# EAGLE design Power Distribution Board Task 6 (EAGLE 8.3.2)
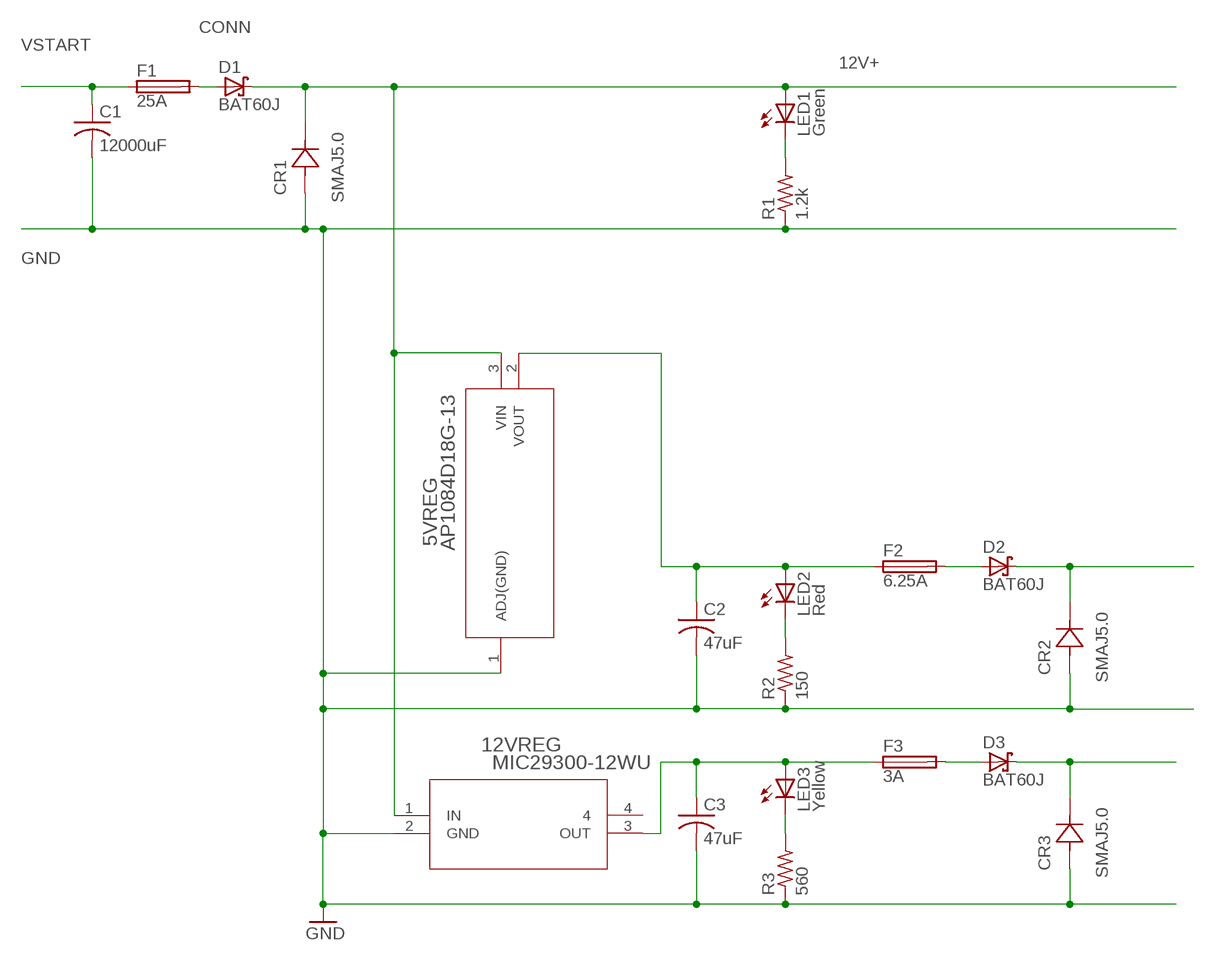
[diagram p0: schematic, sheet 1]

## Parts
5VREG  AP1084D18G-13  [TO252-3L]
12VREG  MIC29300-12WU  [TO-263-3]
C1  12000uF  C-USC1206K  [C1206K]
C2  47uF  C-USC1206K  [C1206K]
C3  47uF  C-USC1206K  [C1206K]
CR1  SMAJ5.0  [SMASERIES]
CR2  SMAJ5.0  [SMASERIES]
CR3  SMAJ5.0  [SMASERIES]
D1  BAT60J  [SOD323_ST]
D2  BAT60J  [SOD323_ST]
D3  BAT60J  [SOD323_ST]
F1  25A  TE5  [TE5]
F2  6.25A  TE5  [TE5]
F3  3A  TE5  [TE5]
LED1  Green  LEDCHIPLED_1206  [CHIPLED_1206]
LED2  Red  LEDCHIPLED_1206  [CHIPLED_1206]
LED3  Yellow  LEDCHIPLED_1206  [CHIPLED_1206]
R1  1.2k  R-US_R1206  [R1206]
R2  150  R-US_R1206  [R1206]
R3  560  R-US_R1206  [R1206]

## Nets
12V+: 5VREG.3(VIN) 12VREG.1(IN) CR1.1 D1.C LED1.A
CONN: D1.A F1.2
GND: 5VREG.1(ADJ(GND)) 12VREG.2(GND) C1.2 C2.2 C3.2 CR1.2 CR2.2 CR3.2 R1.1 R2.1 R3.1
N$6: LED1.C R1.2
N$12: D2.A F2.2
N$13: CR2.1 D2.C
N$15: LED2.C R2.2
N$17: D3.A F3.2
N$18: CR3.1 D3.C
N$20: LED3.C R3.2
VOUT2: 5VREG.2(VOUT) C2.1 F2.1 LED2.A
VOUT3: 12VREG.3(OUT) C3.1 F3.1 LED3.A
VSTART: C1.1 F1.1
Unconnected: 12VREG.4

## Library data of the parts
5VREG = AP108412v_5v:AP1084D18G-13; MANUFACTURER_PART_NUMBER: AP1084D18G13; VENDOR: Diodes Inc
12VREG = MIC29300_12v:MIC29300-12WU; MANUFACTURER_PART_NUMBER: MIC2930012WU; VENDOR: MICREL
C1-C3 = rcl:C-US: CAPACITOR, American symbol
CR1-CR3 = SMAJ5_diode:SMAJ5.0; MANUFACTURER_PART_NUMBER: SMAJ5.0; VENDOR: Littelfuse Inc
D1-D3 = diode:BAT60J: Schottky barrier diode Source: www.st.com, BAT60J.pdf
F1-F3 = fuse:TE5: FUSE Wickmann; OC_FARNELL: unknown; OC_NEWARK: unknown
LED1-LED3 = led:LED: LED OSRAM: - CHIPLED LG R971, LG N971, LY N971, LG Q971, LY Q971, LO R971, LY R971 LH N974, LH R974 LS Q976, LO Q976, LY Q976 LO Q996 - Hyper CHIPLED LW Q18S LB Q993, LB Q99A, LB R99A - SideLED LS A670, LO A670, LY A670, LG A670, LP A670 LB A673, LV A673, LT A673, LW A673 LH A674 LY A675 LS A676, LA A676, LO A676, LY A676, LW A676 LS A679, LY A679, LG A679 - Hyper Micro SIDELED® LS Y876, LA Y876, LO Y876, LY Y876 LT Y87S - SmartLED LW L88C, LW L88S LB L89C, LB L89S, LG L890 LS L89K, LO L89K, LY L89K LS L896, LA L896, LO L896, LY L896 - TOPLED LS T670, LO T670, LY T670, LG T670, LP T670 LSG T670, LSP T670, LSY T670, LOP T670, LYG T670 LG T671, LOG T671, LSG T671 LB T673, LV T673, LT T673, LW T673 LH T674 LS T676, LA T676, LO T676, LY T676, LB T676, LH T676, LSB T676, LW T676 LB T67C, LV T67C, LT T67C, LS T67K, LO T67K, LY T67K, LW E67C LS E67B, LA E67B, LO E67B, LY E67B, LB E67C, LV E67C, LT E67C LW T67C LS T679, LY T679, LG T679 LS T770, LO T770, LY T770, LG T770, LP T770 LB T773, LV T773, LT T773, LW T773 LH T774 LS E675, LA E675, LY E675, LS T675 LS T776, LA T776, LO T776, LY T776, LB T776 LHGB T686 LT T68C, LB T68C - Hyper Mini TOPLED® LB M676 - Mini TOPLED Santana® LG M470 LS M47K, LO M47K, LY M47K Source: http://www.osram.convergy.de LUXEON: - LUMILED® LXK2-PW12-R00, LXK2-PW12-S00, LXK2-PW14-U00, LXK2-PW14-V00 LXK2-PM12-R00, LXK2-PM12-S00, LXK2-PM14-U00 LXK2-PE12-Q00, LXK2-PE12-R00, LXK2-PE12-S00, LXK2-PE14-T00, LXK2-PE14-U00 LXK2-PB12-K00, LXK2-PB12-L00, LXK2-PB12-M00, LXK2-PB14-N00, LXK2-PB14-P00, LXK2-PB14-Q00 LXK2-PR12-L00, LXK2-PR12-M00, LXK2-PR14-Q00, LXK2-PR14-R00 LXK2-PD12-Q00, LXK2-PD12-R00, LXK2-PD12-S00 LXK2-PH12-R00, LXK2-PH12-S00 LXK2-PL12-P00, LXK2-PL12-Q00, LXK2-PL12-R00 Source: www.luxeon.com KINGBRIGHT: KA-3528ASYC Source: www.kingbright.com
R1-R3 = rcl:R-US_: RESISTOR, American symbol

## Board
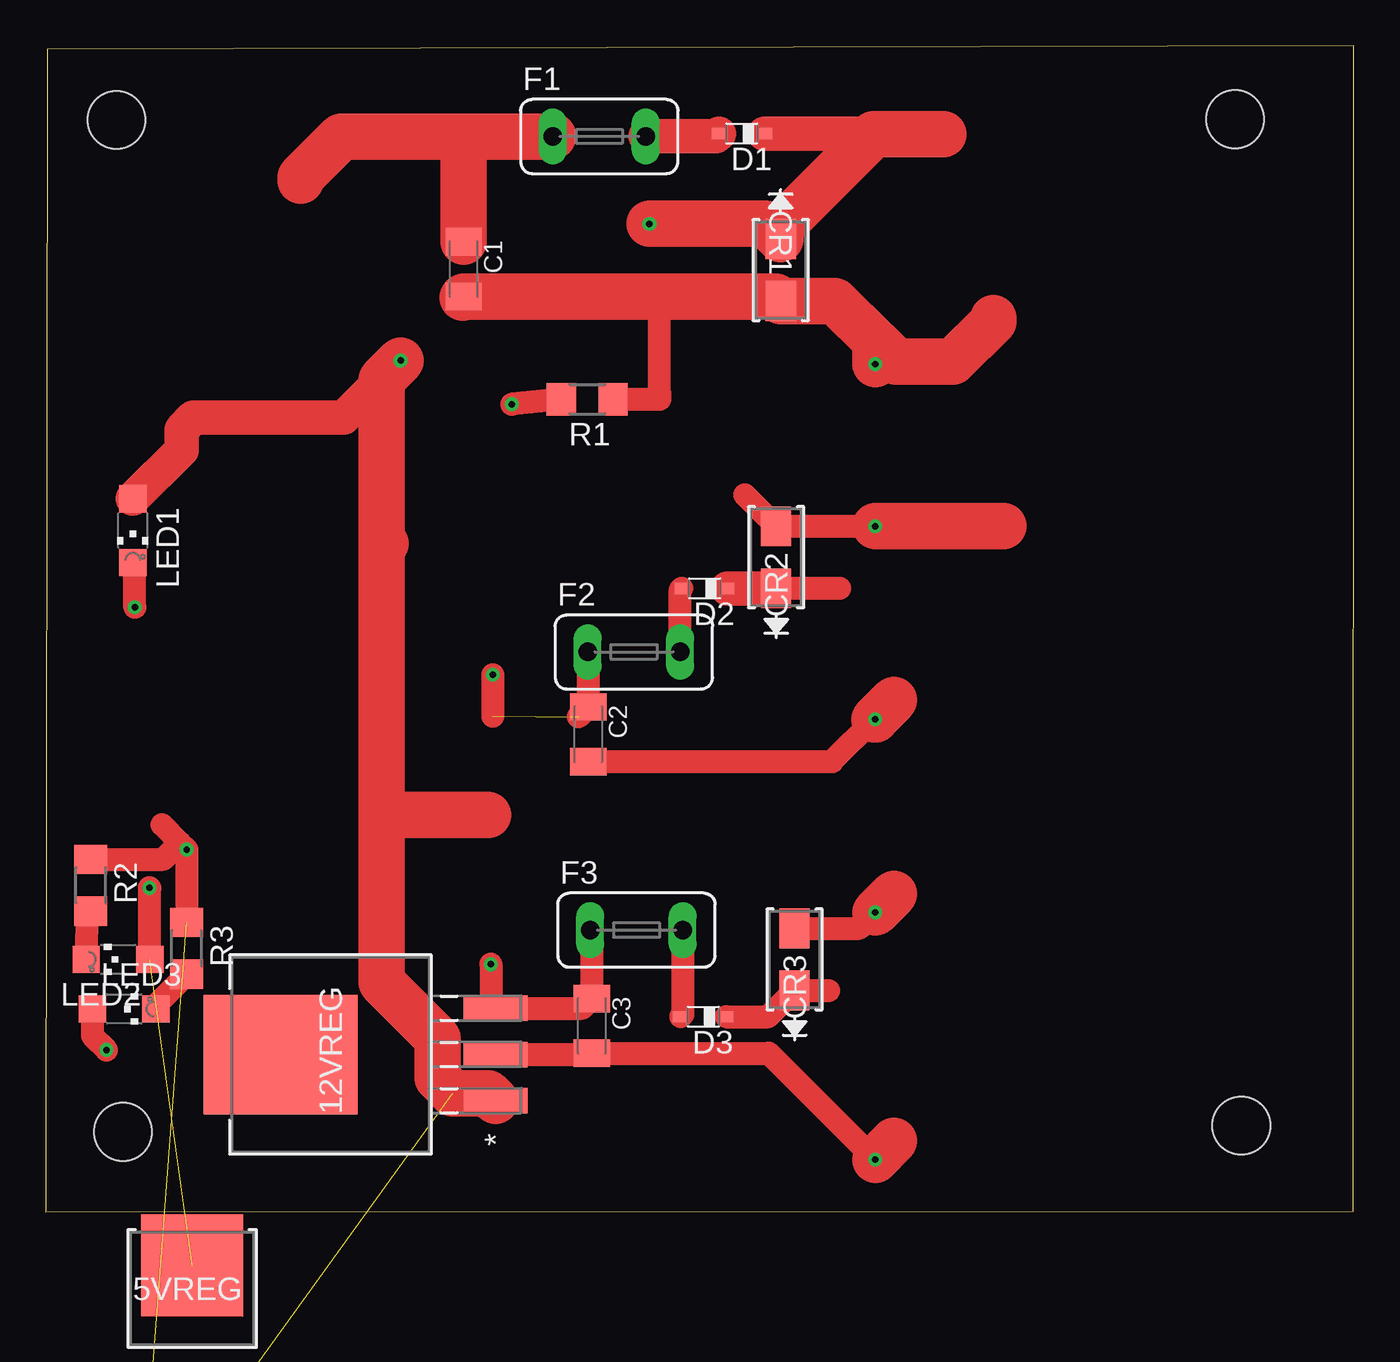
[diagram p1: board, top side]
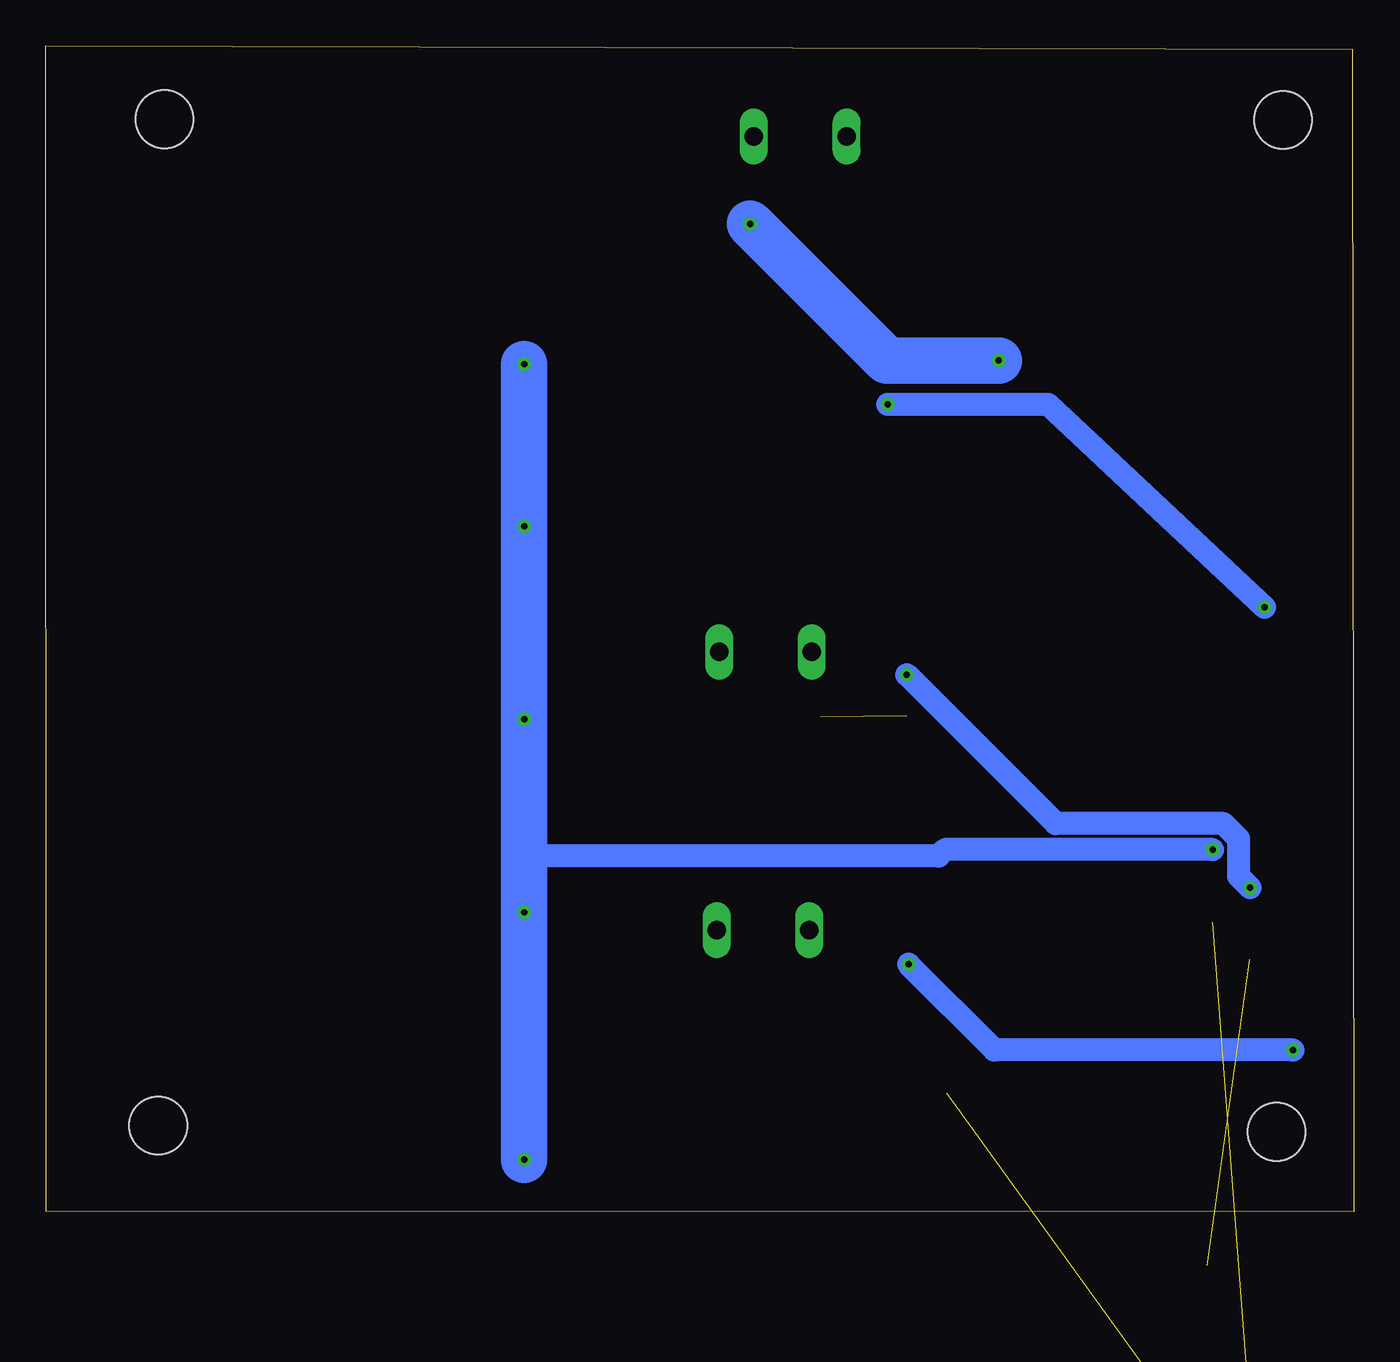
[diagram p2: board, bottom side, seen from below]

Size 71.83 x 64.04 mm. Coordinates in mm from the lower left corner, seen from the top.
Outline: 0,0 71.78,0.05 71.83,64.04 0.1,63.84 0,0
Copper layers (1*16): Top 0.035mm / dielectric 1.5mm / Bottom 0.035mm
Design rules "default": minimum track width 6mil, minimum drill 0.35mm, track to track 6mil, track to pad 6mil, pad to pad 6mil, via to via 6mil, smd to smd 6mil, copper to edge 40mil, drill to drill 6mil, minimum pad ring 10mil, minimum via ring 8mil, stop-mask expansion 4mil, vias tented up to drill 0mil, thermal gap 10mil
Holes 3.17 mm at 3.9,59.95 4.25,4.4 65.65,4.75 65.3,60

### Footprints (pad centres in the part's own frame; a part is rotated, then mirrored left to right if it is on the bottom)
TO252-3L = smd 1.2 x 2: 1 -2.285,-5.93; 3 2.285,-5.93 | smd 5.6 x 5.6: 2 0,1.27
TO-263-3 = smd 1.397 x 3.505: 1 -2.54,-9.055; 2 0,-9.055; 3 2.54,-9.055 | smd 6.553 x 8.458: 4 0,2.743
C1206K = smd 1.5 x 2: 1 -1.5,0; 2 1.5,0
SMASERIES = smd 2.184 x 1.651: 1 -1.702,0; 2 1.702,0
SOD323_ST = smd 0.8 x 0.6: A 1.25,0; C -1.25,0
TE5 = drill 1.016 long: 1 -2.54,0; 2 2.54,0
CHIPLED_1206 = smd 1.5 x 1.5: A 0,-1.75; C 0,1.75
R1206 = smd 1.6 x 1.803: 1 -1.422,0; 2 1.422,0

### Placement (x,y rotation side)
5VREG  8.05,-4.2 0 top
12VREG  15.65,8.65 90 top
C1  22.95,51.76 270 top
C2  29.8,26.23 270 top
C3  29.99,10.22 270 top
CR1  40.36,51.71 270 top
CR2  40.11,35.95 90 top
CR3  41.12,13.87 90 top
D1  38.23,59.21 180 top
D2  36.18,34.24 180 top
D3  36.11,10.72 180 top
F1  30.4,59.05 0 top
F2  32.3,30.75 0 top
F3  32.44,15.48 0 top
LED1  4.79,37.41 180 top
LED2  3.98,13.87 90 top
LED3  4.32,11.15 270 top
R1  29.74,44.62 180 top
R2  2.48,17.94 270 top
R3  7.75,14.48 270 top

### Tracks (layer width: path | path; a pad name or v marks a point on that pad's centre or on a via)
12V+  (via drill 0.35)  (1 unrouted)
  Top 1.905: D1.C 45.4,59.21 45.45,59.16 | v19.5,46.75 16.36,43.61 8.12,43.61 7.47,42.96 7.47,41.84 LED1.A
  Top 2.54: 12VREG.1 24.28,6.53 22.36,6.53 21.53,7.36 21.53,9.54 18.45,12.62 18.45,21.8 | 18.45,21.8 18.45,36.9 | 18.45,21.8 24.3,21.8 | 18.66,36.69 18.45,36.9 | 49.29,59.16 45.45,59.16 40.36,54.07 CR1.1 39.52,54.25 v33.15,54.25 | v19.5,46.75 18.45,45.7 18.45,36.9
  Bottom 2.54: v19.5,46.75 25.65,46.75 v33.15,54.25
CONN
  Top 1.905: F1.2 36.82,59.05 D1.A
GND  (via drill 0.35)  (1 unrouted)
  Top 1.27: R1.1 33.72,44.62 33.7,45.5 33.7,50.26 | 29.71,24.64 C2.2 43.18,24.73 45.5,27.05 | R3.1 v7.75,19.9 7.38,20.27 | 7.38,20.27 6.39,21.26 | R2.1 6.46,19.36 7.38,20.27 | 46.68,46.67 48.92,46.67 | 38.38,39.38 CR2.2 45.6,37.65 v45.55,37.65 | 12VREG.2 29.92,8.65 C3.2 39.71,8.72 v45.55,2.88 | CR3.2 44.67,15.57 v45.55,16.45
  Top 2.54: 22.9,50.21 C1.2 33.7,50.26 40.11,50.26 CR1.2 43.35,50.01 45.58,47.78 | 45.58,47.78 46.68,46.67 49.82,46.67 52.04,48.89 52.04,49.09 | v45.55,2.88 46.57,3.9 | v45.55,16.45 46.57,17.48 | 46.57,28.12 45.5,27.05 v45.55,27.05 | v45.55,46.55 45.55,47.75 45.58,47.78 | v45.55,37.65 52.59,37.65
  Bottom 1.27: v7.75,19.9 22.45,19.9 22.8,19.55 45.35,19.55 45.55,19.75
  Bottom 2.54: v45.55,2.88 v45.55,16.45 45.55,19.75 v45.55,27.05 v45.55,37.65 v45.55,46.55
N$6  (via drill 0.35)
  Top 1.27: R1.2 v25.61,44.34 v25.6,44.35 | v4.9,33.2 4.9,35.55 LED1.C
  Bottom 1.27: v25.6,44.35 16.8,44.35 v4.9,33.2
N$12
  Top 1.27: F2.2 34.84,34.15 D2.A
N$13
  Top 1.27: CR2.1 43.6,34.25
  Top 1.905: D2.C CR2.1
N$15
  Top 1.27: LED2.C 2.28,15.76 R2.2
N$17
  Top 1.27: F3.2 34.98,10.84 D3.A
N$18
  Top 1.27: D3.C 39.67,10.72 CR3.1 43.01,12.17
N$20
  Top 1.27: LED3.C 6.07,11.38 R3.2
VOUT2  (via drill 0.35)  (2 unrouted)
  Top 1.27: 29.25,27.18 C2.1 29.8,30.71 F2.1 | LED2.A 5.73,17.77 v5.7,17.8 | v24.55,29.5 24.55,27.23
  Bottom 1.27: v24.55,29.5 16.37,21.32 7.16,21.32 6.33,20.49 6.33,18.43 v5.7,17.8
VOUT3  (via drill 0.35)
  Top 1.27: LED3.A 2.57,9.68 v3.35,8.9 | v24.45,13.6 24.45,11.44 12VREG.3 29.46,11.19 C3.1 29.99,15.39 F3.1
  Bottom 1.27: v3.35,8.9 19.75,8.9 v24.45,13.6
VSTART
  Top 2.54: 14.01,56.62 14.01,56.82 16.23,59.04 22.8,59.04 | F1.1 27.85,59.04 22.8,59.04 | C1.1 22.95,58.89 22.8,59.04